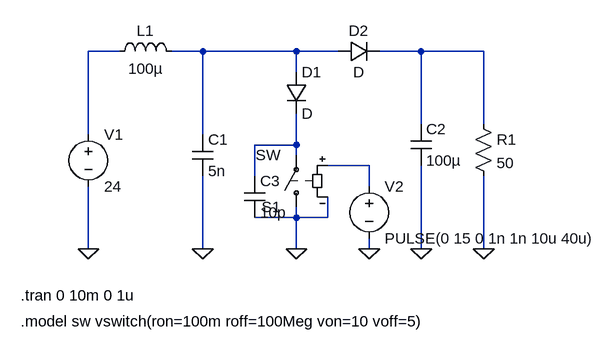
[diagram p0: schematic zvs_boost.asc]
zvs_boost.asc, the LTspice schematic file:
Version 4
SHEET 1 880 680
WIRE 48 -16 0 -16
WIRE 176 -16 128 -16
WIRE 320 -16 176 -16
WIRE 384 -16 320 -16
WIRE 512 -16 448 -16
WIRE 608 -16 512 -16
WIRE 320 16 320 -16
WIRE 512 96 512 -16
WIRE 608 96 608 -16
WIRE 0 112 0 -16
WIRE 176 112 176 -16
WIRE 320 128 320 80
WIRE 320 128 256 128
WIRE 320 144 320 128
WIRE 432 160 368 160
WIRE 256 176 256 128
WIRE 432 192 432 160
WIRE 320 240 320 224
WIRE 320 240 256 240
WIRE 368 240 368 208
WIRE 368 240 320 240
WIRE 0 288 0 192
WIRE 176 288 176 176
WIRE 320 288 320 240
WIRE 432 288 432 272
WIRE 512 288 512 160
WIRE 608 288 608 176
FLAG 0 288 0
FLAG 176 288 0
FLAG 320 288 0
FLAG 512 288 0
FLAG 608 288 0
FLAG 432 288 0
SYMBOL voltage 0 96 R0
WINDOW 123 0 0 Left 2
WINDOW 39 0 0 Left 2
SYMATTR InstName V1
SYMATTR Value 24
SYMBOL ind 32 0 R270
WINDOW 0 32 56 VTop 2
WINDOW 3 5 56 VBottom 2
SYMATTR InstName L1
SYMATTR Value 100µ
SYMATTR SpiceLine Rser=0.1
SYMBOL cap 160 112 R0
SYMATTR InstName C1
SYMATTR Value 5n
SYMBOL diode 304 16 R0
SYMATTR InstName D1
SYMBOL diode 384 0 R270
WINDOW 0 32 32 VTop 2
WINDOW 3 0 32 VBottom 2
SYMATTR InstName D2
SYMBOL sw 320 240 R180
SYMATTR InstName S1
SYMBOL cap 496 96 R0
SYMATTR InstName C2
SYMATTR Value 100µ
SYMBOL res 592 80 R0
SYMATTR InstName R1
SYMATTR Value 50
SYMBOL voltage 432 176 R0
WINDOW 123 0 0 Left 2
WINDOW 39 0 0 Left 2
SYMATTR InstName V2
SYMATTR Value PULSE(0 15 0 1n 1n 10u 40u)
SYMBOL cap 240 176 R0
SYMATTR InstName C3
SYMATTR Value 10p
TEXT -104 400 Left 2 !.model sw vswitch(ron=100m roff=100Meg von=10 voff=5)
TEXT -104 360 Left 2 !.tran 0 10m 0 1u

The netlist it stands for:
* zvs_boost.asc
V1 N001 0 24
L1 N001 N002 100µ Rser=0.1
C1 N002 0 5n
D1 N002 N004 D
D2 N002 N003 D
S1 0 N004 N005 0 SW
C2 N003 0 100µ
R1 N003 0 50
V2 N005 0 PULSE(0 15 0 1n 1n 10u 40u)
C3 N004 0 10p
.model D D
.lib standard.dio
.model sw vswitch(ron=100m roff=100Meg von=10 voff=5)
.tran 0 10m 0 1u
.backanno
.end